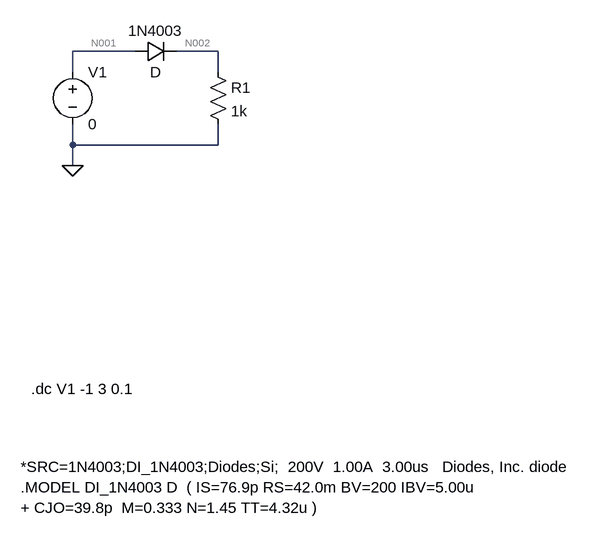
[diagram p0: schematic A1_schema.asc]
A1_schema.asc, the LTspice schematic file:
Version 4.1
SHEET 1 880 760
WIRE 48 48 -48 48
WIRE 176 48 112 48
WIRE -48 80 -48 48
WIRE 176 80 176 48
WIRE -48 192 -48 160
WIRE 176 192 176 160
WIRE 176 192 -48 192
WIRE -48 224 -48 192
FLAG -48 224 0
SYMBOL diode 48 64 R270
WINDOW 0 32 32 VTop 2
WINDOW 3 0 32 VBottom 2
SYMATTR InstName 1N4003
SYMBOL res 160 64 R0
SYMATTR InstName R1
SYMATTR Value 1k
SYMBOL voltage -48 64 R0
WINDOW 123 0 0 Left 0
WINDOW 39 0 0 Left 0
SYMATTR InstName V1
SYMATTR Value 0
TEXT -128 688 Left 2 !*SRC=1N4003;DI_1N4003;Diodes;Si;  200V  1.00A  3.00us   Diodes, Inc. diode\n.MODEL DI_1N4003 D  ( IS=76.9p RS=42.0m BV=200 IBV=5.00u\n+ CJO=39.8p  M=0.333 N=1.45 TT=4.32u )
TEXT -112 568 Left 2 !.dc V1 -1 3 0.1

The netlist it stands for:
* A1_schema.asc
D§1N4003 N001 N002 D
R1 N002 0 1k
V1 N001 0 0
.model D D
.lib standard.dio
*SRC=1N4003;DI_1N4003;Diodes;Si;  200V  1.00A  3.00us   Diodes, Inc. diode
.MODEL DI_1N4003 D  ( IS=76.9p RS=42.0m BV=200 IBV=5.00u
+ CJO=39.8p  M=0.333 N=1.45 TT=4.32u )
.dc V1 -1 3 0.1
.backanno
.end

* Results of the author's LTspice run, read from the files saved beside the schematic
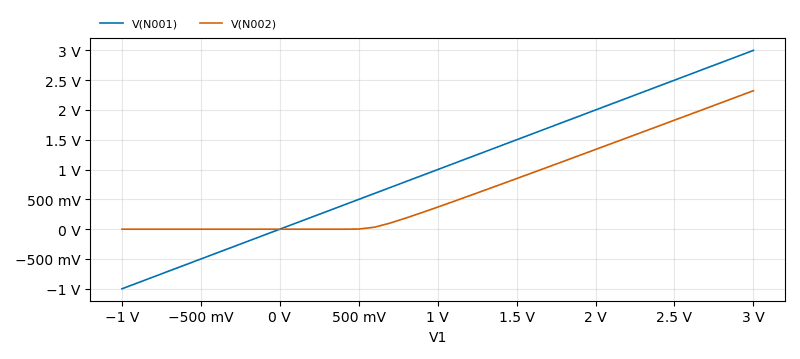
[diagram p1: DC transfer characteristic of A1_schema.asc, plotted from the saved traces]
* DC transfer characteristic, 1 run:
*   V(N001): -1 V at V1=-1 V, 3 V at V1=3 V, min -1 V, max 3 V
*   V(N002): -1.01 nV at V1=-1 V, 2.323 V at V1=3 V, min -1.01 nV, max 2.323 V